# Altium schematic sheet LED_String_NE2B757GT.SchDoc: STB Light Board - blue String
size A4; Author: flmoll; DrawnBy: flmoll; Organization: PBL; Revision: A; SheetNumber: 10; SheetTotal: 20
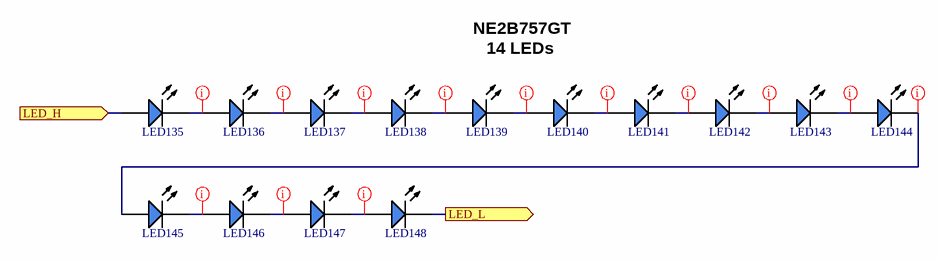
[diagram p0: LED_String_NE2B757GT.SchDoc]

## Parts
LED135  NE2B757GT  [NE2B757GT]  (value not drawn)
LED136  NE2B757GT  [NE2B757GT]  (value not drawn)
LED137  NE2B757GT  [NE2B757GT]  (value not drawn)
LED138  NE2B757GT  [NE2B757GT]  (value not drawn)
LED139  NE2B757GT  [NE2B757GT]  (value not drawn)
LED140  NE2B757GT  [NE2B757GT]  (value not drawn)
LED141  NE2B757GT  [NE2B757GT]  (value not drawn)
LED142  NE2B757GT  [NE2B757GT]  (value not drawn)
LED143  NE2B757GT  [NE2B757GT]  (value not drawn)
LED144  NE2B757GT  [NE2B757GT]  (value not drawn)
LED145  NE2B757GT  [NE2B757GT]  (value not drawn)
LED146  NE2B757GT  [NE2B757GT]  (value not drawn)
LED147  NE2B757GT  [NE2B757GT]  (value not drawn)
LED148  NE2B757GT  [NE2B757GT]  (value not drawn)

## Ports
LED_H (in, see LED_Driver_NE2B757GT[3B]), LED_L (out, see LED_Driver_NE2B757GT[3B])

## Nets
LED_H: LED135.2(A) ; port LED_H
LED_L: LED148.1(K) ; port LED_L
NetLED135_1: LED135.1(K) LED136.2(A)
NetLED136_1: LED136.1(K) LED137.2(A)
NetLED137_1: LED137.1(K) LED138.2(A)
NetLED138_1: LED138.1(K) LED139.2(A)
NetLED139_1: LED139.1(K) LED140.2(A)
NetLED140_1: LED140.1(K) LED141.2(A)
NetLED141_1: LED141.1(K) LED142.2(A)
NetLED142_1: LED142.1(K) LED143.2(A)
NetLED143_1: LED143.1(K) LED144.2(A)
NetLED144_1: LED144.1(K) LED145.2(A)
NetLED145_1: LED145.1(K) LED146.2(A)
NetLED146_1: LED146.1(K) LED147.2(A)
NetLED147_1: LED147.1(K) LED148.2(A)

## Layout directives
net class LED: NetLED135_1, NetLED136_1, NetLED137_1, NetLED138_1, NetLED139_1, NetLED140_1, NetLED141_1, NetLED142_1, NetLED143_1, NetLED144_1, NetLED145_1, NetLED146_1, NetLED147_1

## Notes on the sheet
- NE2B757GT
- 14 LEDs
- 1
- 2
- 3
- 4
- A
- B
- C
- Project:
- D
- Date:
- Drawing number:
- Rev:
- Format:
- A4 Q
- Drawn by:
- Laboratory:
- Page
- Sheet:
- of
- File:

## Library data of the parts
LED135-LED148 = CMP-02060-1: SMD LED White 2,9 V, 8,7 lm 3030 (1212); Manufacturer: Nichia; Optoelectronic Device Type: SINGLE COLOR LED; Color: Blue; Vf: 2.9 V; Intensity: 8.7 lm; REACH SVHC: No SVHC; RoHS Compliant: Yes; Manufacturer Part Number: NE2B757GT